# EasyEDA Pro project 主板.epro, board 主板
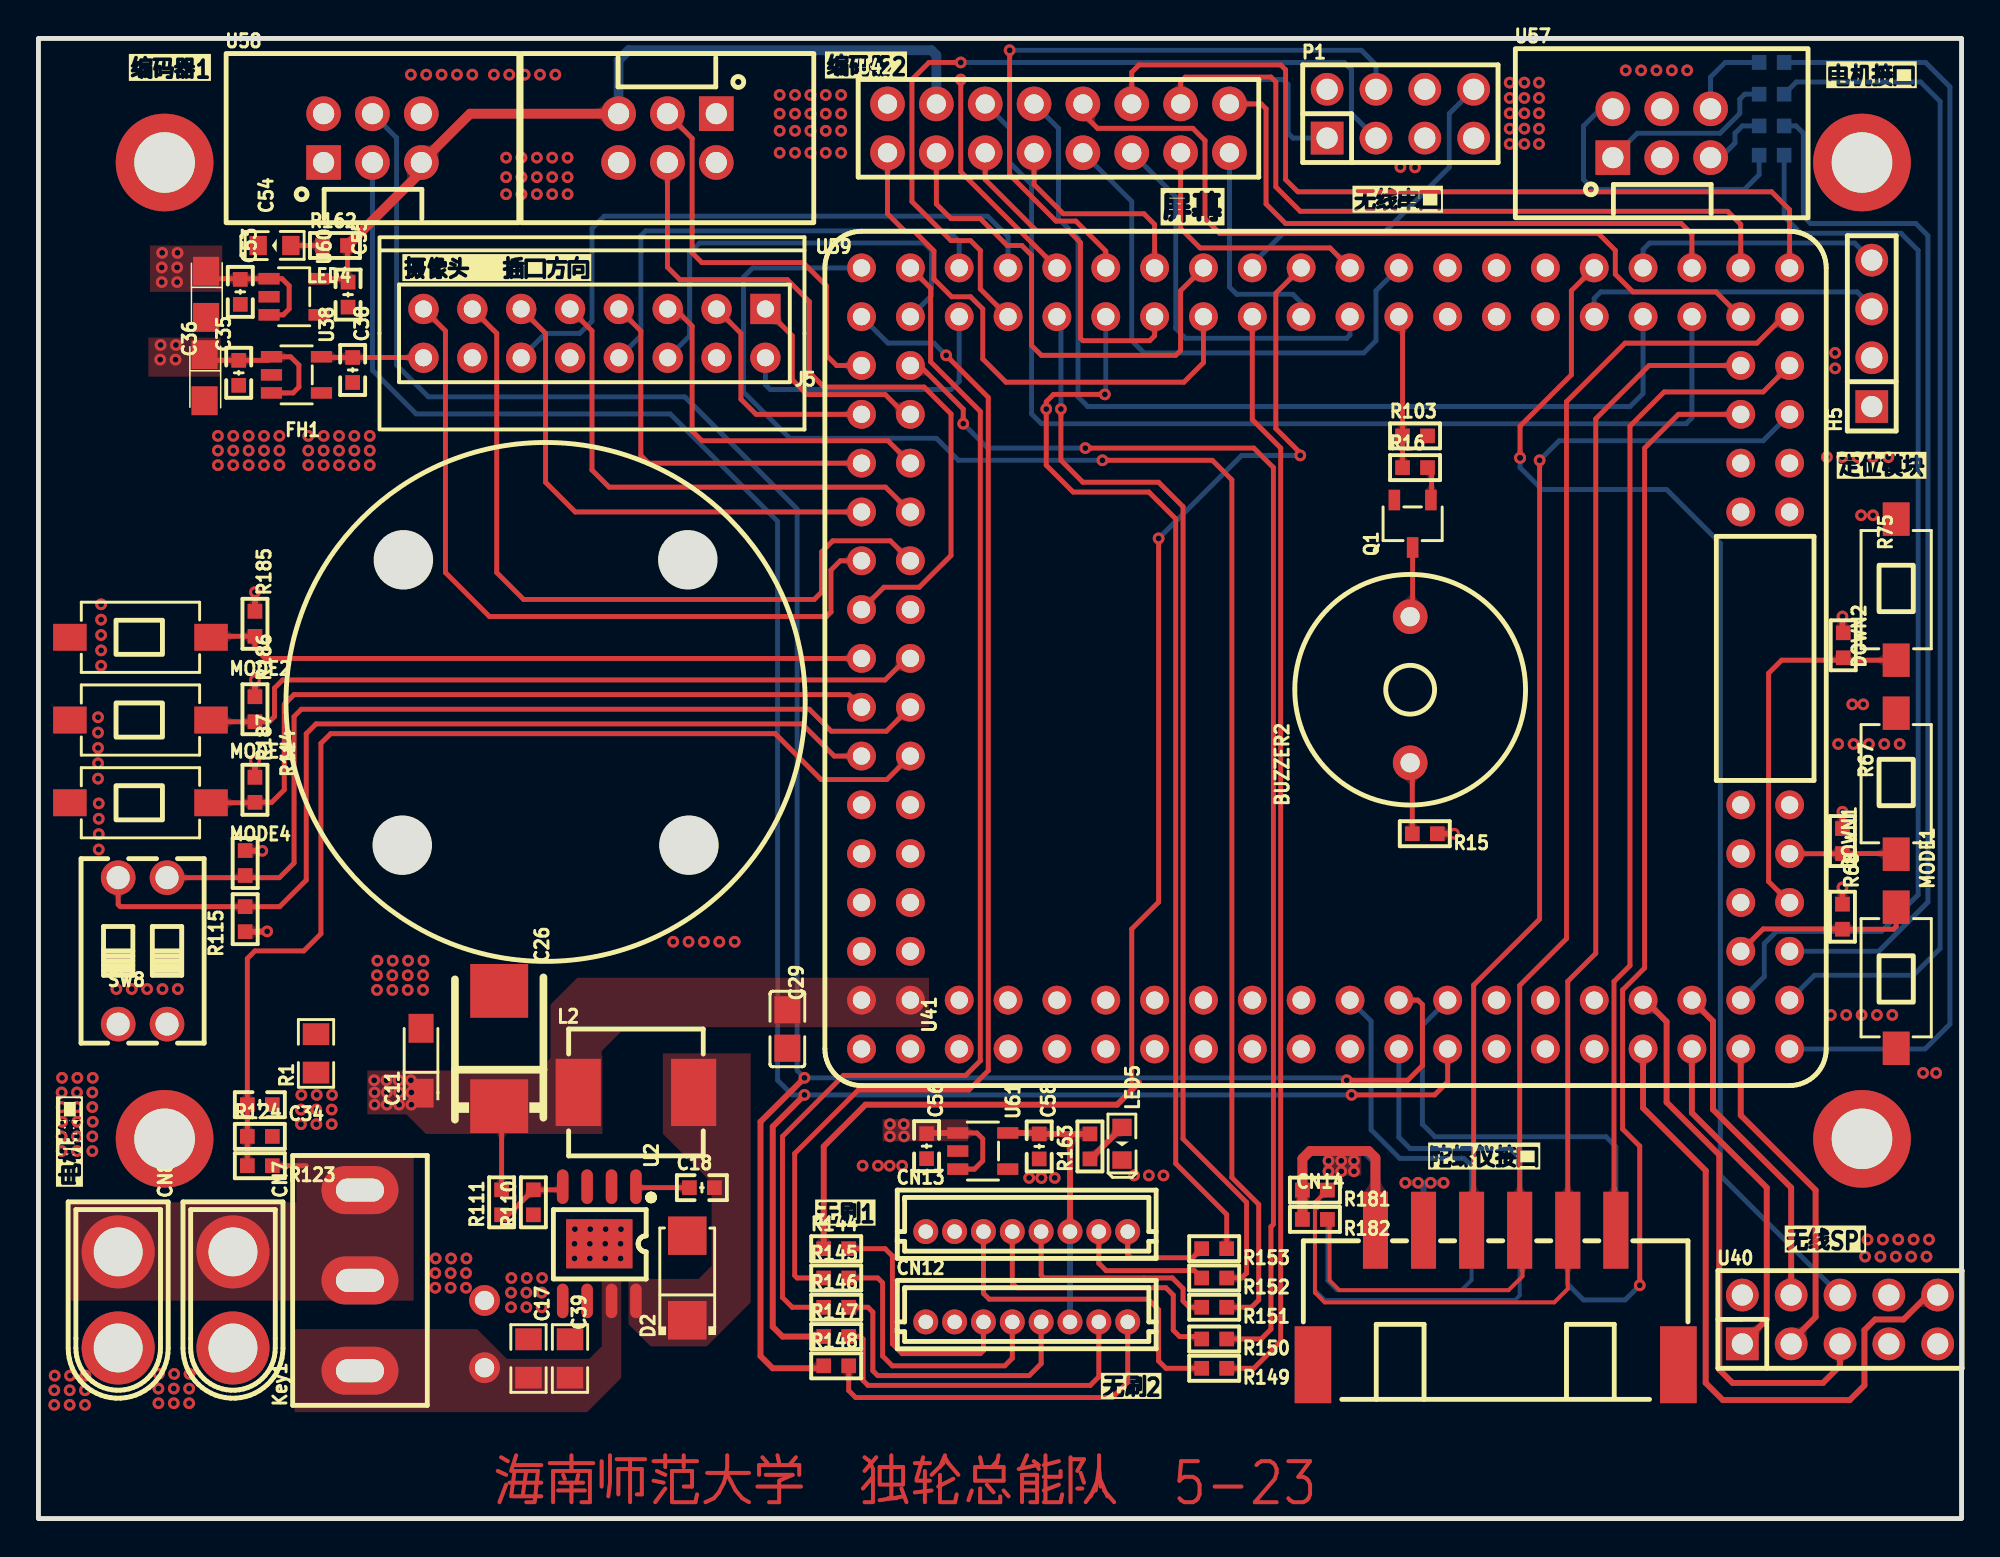
[diagram p1: board, top side]
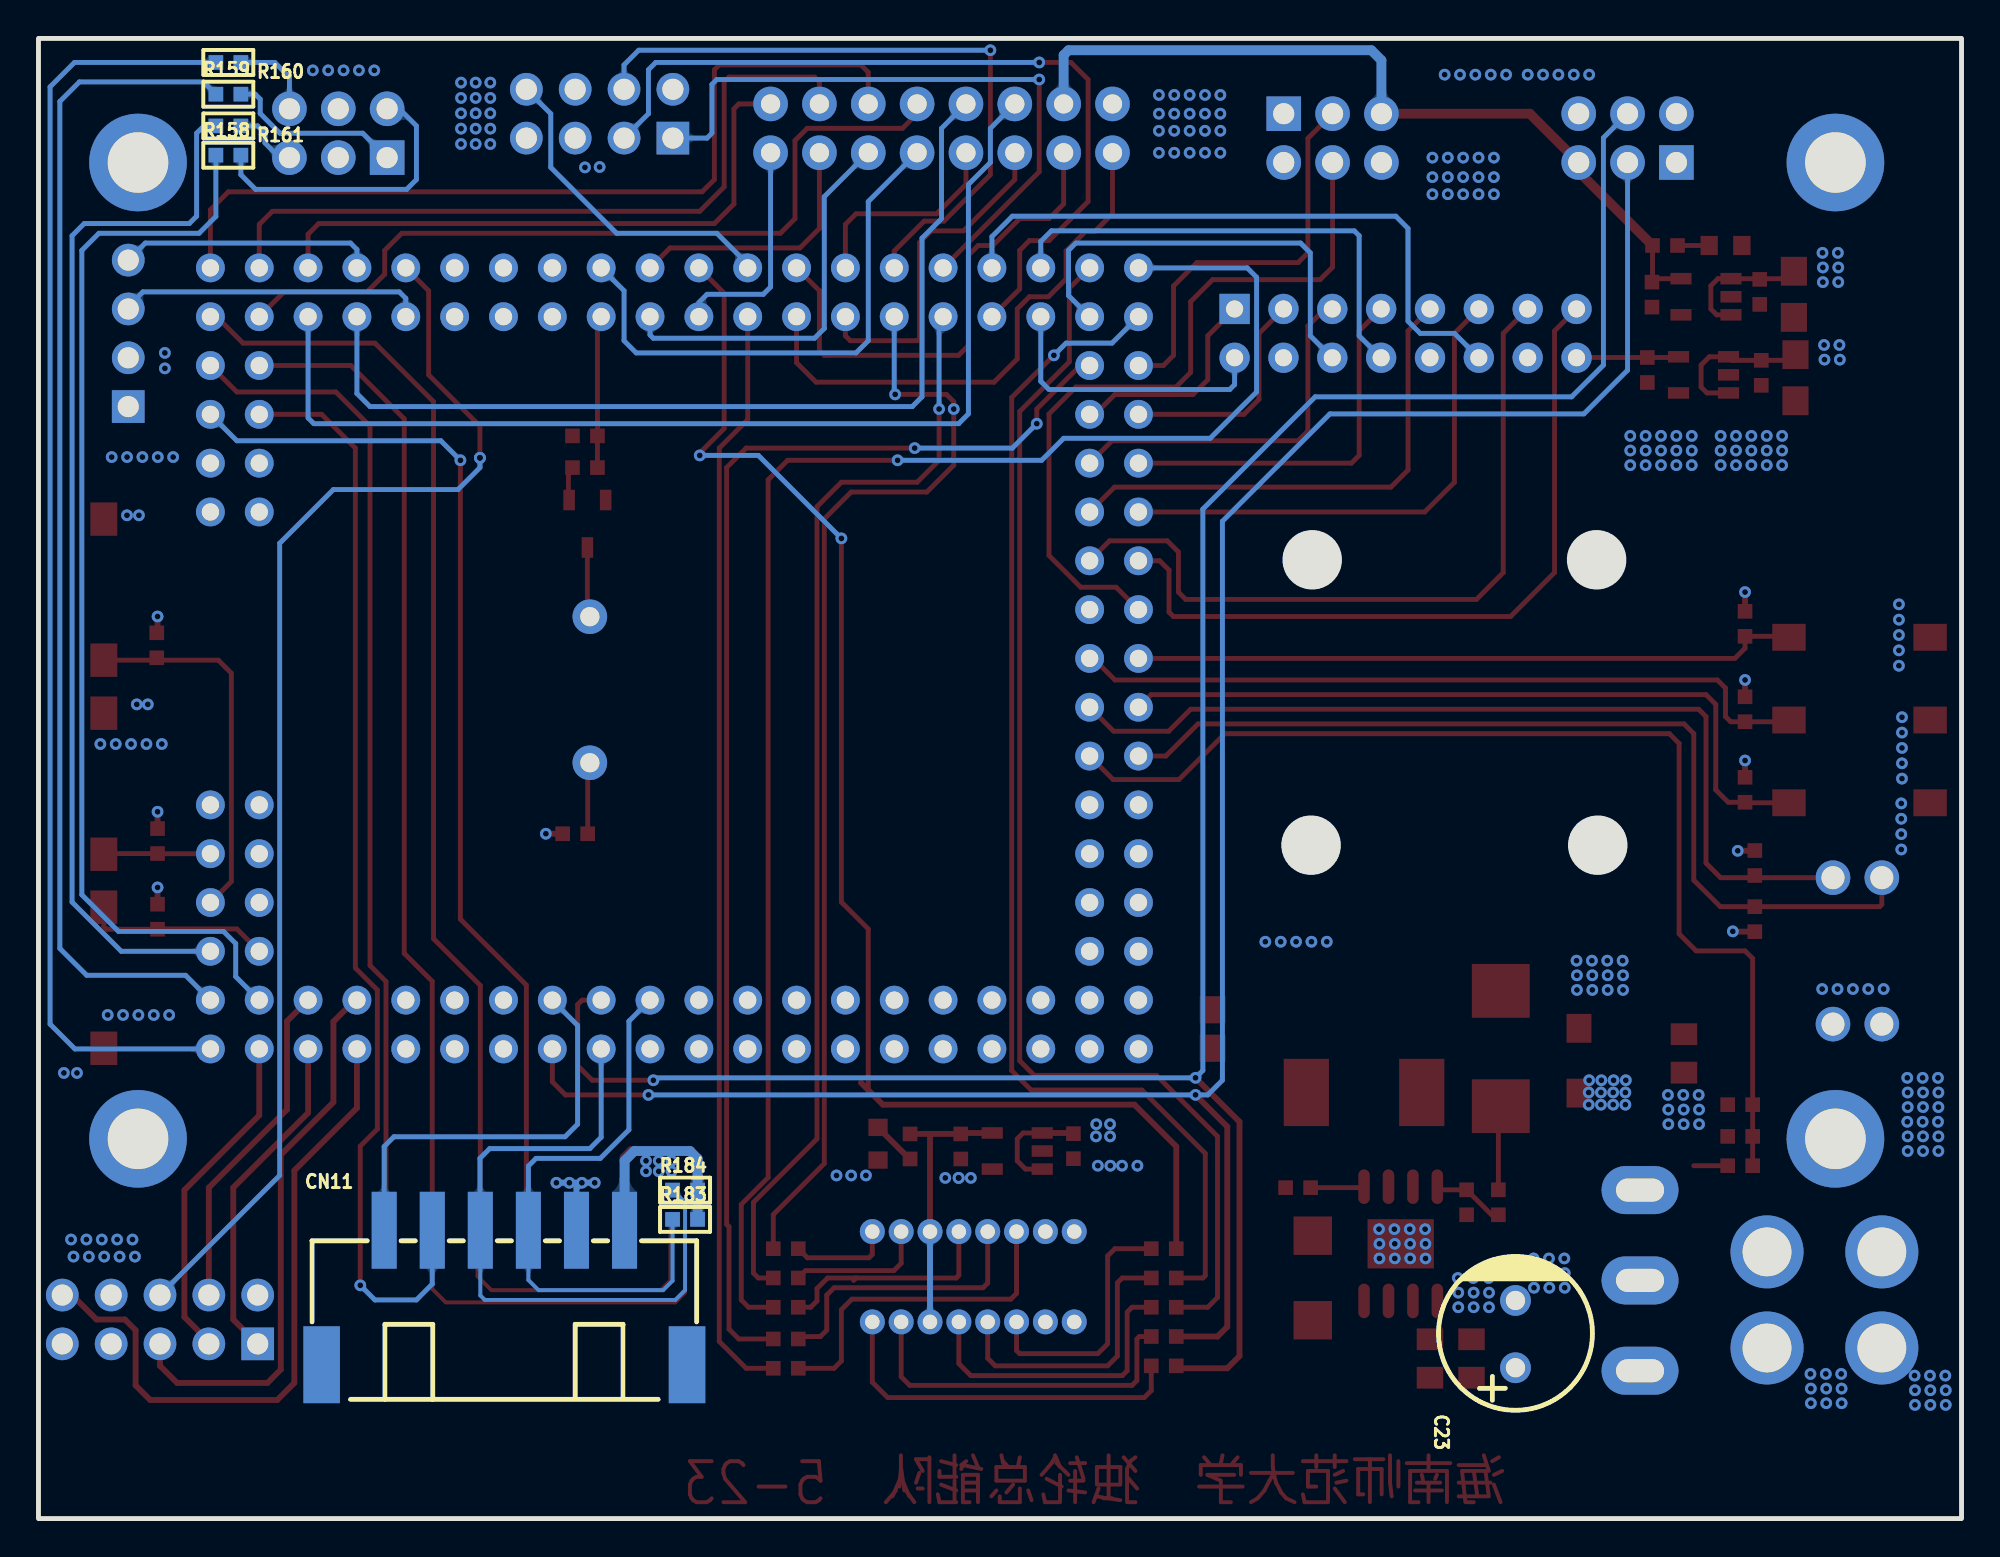
[diagram p2: board, bottom side, seen from below]

Outline 100 x 77.01 mm; copper layers: Top Layer, GND, VCC, Bottom Layer. Coordinates in mm from the lower left corner of the outline.
Outline path: rectangle 0,77.01 100,0
Stack: Top Layer 0.035mm 外层铜厚1oz / Dielectric1 0.2104mm 7628 RC49% 8.6mil / GND 0.035mm - / Dielectric2 1.065mm 1.1mm H/HOZ 含铜 / VCC 0.035mm - / Dielectric3 0.2104mm 7628 RC49% 8.6mil / Bottom Layer 0.035mm 外层铜厚1oz

## Design rules (mm)
template: 自定义配置
spacing copperThickness1oz (default): track to track 0.102, other pairs 0.152 to 0.3
spacing copperThickness2oz: track to track 0.203, other pairs 0.152 to 0.3
track width copperThickness1oz (default): min 0.127, default 0.254, max 2.54
track width copperThickness2oz: min 0.203, default 0.254, max 2.54
differential pair differentialPair (default): width min 0.127, default 0.254, max 2.54; gap min 0.152, default 0.152
via viaSize (default): diameter min 0.5, default 0.61, max 10; hole min 0.3, default 0.305, max 6.299
net GND uses copperRegion1
net VCC uses copperRegion1
net GND_MCU uses copperRegion2
net BAT uses copperRegion1

## Placement (name value [footprint] x y rotation side)
BUZZER2  2300Hz  [BUZ-TH_BD12.0-P7.60-D0.6-FD]  71.33 43.13 90 top
C11  10uF  [CAP-SMD_L3.2-W1.6-RD]  19.89 23.82 90 top
C17  47uf  [R0805_1]  25.48 8.33 270 top
C18  10nf  [电容0603 ad]  34.5 17.22 0 top
C23  470uf  [CAP-TH_BD8.0-P3.50-D0.6-FD]  23.2 9.6 90 bottom
C26  220uF  [CASE-D_7343]  23.96 24.46 270 top
C29  100NF  [C0805_1]  38.94 25.47 270 top
C34  100NF  [电容0603 ad]  11.51 21.54 180 top
C35  100nf  [电容0603 ad]  10.41 59.61 270 top
C36  10uF16V  [CASE-A_3216]  8.64 59.36 270 top
C38  100nf  [电容0603 ad]  16.34 59.76 270 top
C39  47uf  [R0805_1]  27.64 8.33 270 top
C53  100nf  [电容0603 ad]  10.5 63.83 270 top
C54  10uF16V  [CASE-A_3216]  8.72 63.7 270 top
C55  100nf  [电容0603 ad]  16.1 63.68 270 top
C56  100nf  [电容0603 ad]  46.18 19.38 270 top
C58  100nf  [电容0603 ad]  52.04 19.36 270 top
CN7  电机1  [conn-th_xt30u-m]  10.11 11.38 270 top
CN8  电机1  [conn-th_xt30u-m]  4.15 11.38 270 top
CN11  HX25003-6AWB  [CONN-SMD_6P-P2.50_HX25003-6AWB]  75.77 11.5 180 bottom
CN12  HC-ZH1.5-8A  [CONN-TH_HC-ZH1.5-8A]  51.39 10.23 0 top
CN13  HC-ZH1.5-8A  [CONN-TH_HC-ZH1.5-8A]  51.39 14.93 0 top
CN14  HX25003-6AWB  [CONN-SMD_6P-P2.50_HX25003-6AWB]  75.77 11.5 0 top
D2  ss34  [SMA_L4.3-W2.6-LS5.2-RD]  33.74 12.52 90 top
DOWN1  ST-1101NE-H H=4.3mm  [SW-SMD_L6.0-W3.5-LS8.0]  96.6 38.24 90 top
DOWN2  ST-1101NE-H H=4.3mm  [SW-SMD_L6.0-W3.5-LS8.0]  96.6 48.33 90 top
FH1  智能车逐飞摄像头固定孔  [智能车逐飞摄像头支架固定孔]  26.37 42.49 0 top
H5  PZ254V-11-04P  [HDR-TH_4P-P2.54-V-M]  95.33 61.67 90 top
J5  HDR-M-2.54_2x8  [HDR-M-2.54_2X8]  28.91 61.67 180 top
Key1  -  [MTS102/3脚2档]  16.72 12.39 90 top
L2  10UH  [IND-SMD_L7.3-W6.8]  31.07 22.17 0 top
LED4  LED-0603_R  [LED0603_RED]  12.27 66.24 180 top
LED5  LED-0603_R  [LED0603_RED]  56.34 19.5 270 top
MODE1  ST-1101NE-H H=4.3mm  [SW-SMD_L6.0-W3.5-LS8.0]  96.6 28.14 270 top
MODE2  ST-1101NE-H H=4.3mm  [SW-SMD_L6.0-W3.5-LS8.0]  5.3 45.85 180 top
MODE3  ST-1101NE-H H=4.3mm  [SW-SMD_L6.0-W3.5-LS8.0]  5.3 41.55 180 top
MODE4  ST-1101NE-H H=4.3mm  [SW-SMD_L6.0-W3.5-LS8.0]  5.3 37.24 180 top
NOREF  -  [Pad_e408]  6.56 19.76 0 top
NOREF#2  -  [Pad_e120]  6.56 70.56 0 top
NOREF#3  -  [Pad_e407]  94.82 19.76 0 top
NOREF#4  -  [Pad_e122]  94.82 70.56 0 top
P1  无线串口  [HDR-TH_8P-P2.54-V-M-R2-C4-S2.54]  70.82 73.1 0 top
Q1  S8050  [SOT-23-3_L2.9-W1.6-P1.90-LS2.8-BR]  71.46 51.76 90 top
R1  0R  [R0805_1]  14.43 24.2 90 top
R15  10R  [r0603 ad]  72.09 35.63 180 top
R16  4.7K  [r0603 ad]  71.58 54.68 0 top
R67  10K  [r0603 ad]  93.81 35.25 270 top
R68  10K  [r0603 ad]  93.81 31.31 270 top
R75  10K  [r0603 ad]  93.85 45.44 270 top
R103  1K  [r0603 ad]  71.58 56.33 0 top
R110  3.24k  [r0603 ad]  25.74 16.46 90 top
R111  10K  [r0603 ad]  24.08 16.46 90 top
R114  10K  [r0603 ad]  10.75 34.11 270 top
R115  10K  [r0603 ad]  10.75 31.19 90 top
R123  100k  [r0603 ad]  11.51 18.36 180 top
R124  10k  [r0603 ad]  11.51 19.88 0 top
R144  100R  [r0603 ad]  41.48 14.04 0 top
R145  100R  [r0603 ad]  41.48 12.52 0 top
R146  100R  [r0603 ad]  41.48 10.99 0 top
R147  100R  [r0603 ad]  41.48 9.47 0 top
R148  100R  [r0603 ad]  41.48 7.95 0 top
R149  100R  [r0603 ad]  61.14 7.82 180 top
R150  100R  [r0603 ad]  61.14 9.34 180 top
R151  100R  [r0603 ad]  61.14 10.99 180 top
R152  100R  [r0603 ad]  61.14 12.52 180 top
R153  100R  [r0603 ad]  61.14 14.04 180 top
R158  100R  [r0603 ad]  90.12 70.94 180 bottom
R159  100R  [r0603 ad]  90.12 74.11 180 bottom
R160  100R  [r0603 ad]  90.12 75.76 0 bottom
R161  100R  [r0603 ad]  90.12 72.46 0 bottom
R162  4.7k  [r0603 ad]  15.42 66.24 0 top
R163  4.7k  [r0603 ad]  54.68 19.36 90 top
R181  10K  [r0603 ad]  66.38 17.09 180 top
R182  10K  [r0603 ad]  66.38 15.57 180 top
R183  10K  [r0603 ad]  66.38 15.57 180 bottom
R184  10K  [r0603 ad]  66.38 17.09 180 bottom
R185  10K  [r0603 ad]  11.26 46.55 270 top
R186  10K  [r0603 ad]  11.26 42.11 270 top
R187  10K  [r0603 ad]  11.26 37.92 270 top
SW8  DSWB02LHGET  [SW-TH_DSWB02LHGET]  5.42 29.54 0 top
U2  TPS5430DDAR  [soic-8_l5.0-w4.0-p1.27-ls6.0-tl-ep]  29.16 14.3 270 top
U38  RT9013-3.3GB  [SOT-23-5_L2.9-W1.6-P0.94-LS2.8-BL]  13.42 59.51 270 top
U40  ZX-PZ2.54-2-5PZZ  [HDR-TH_10P-P2.54-V-M-R2-C5-S2.54]  93.68 10.36 0 top
U41  -  [TC264]  66.93 44.76 90 top
U42  PM254-2-08-Z-8.5  [HDR-TH_16P-P2.54-V-F-R2-C8-S2.54]  53.04 72.34 0 top
U57  2*3简牛  [CONN-TH_6P-P2.54_KINGHELM_KH-2.54PH180-2X3P-L8.9]  84.41 72.08 0 top
U58  2*3简牛  [CONN-TH_6P-P2.54_KINGHELM_KH-2.54PH180-2X3P-L8.9]  17.37 71.83 0 top
U59  2*3简牛  [CONN-TH_6P-P2.54_KINGHELM_KH-2.54PH180-2X3P-L8.9]  32.71 71.83 180 top
U60  RT9013-3.3GB  [SOT-23-5_L2.9-W1.6-P0.94-LS2.8-BL]  13.29 63.57 270 top
U61  RT9013-3.3GB  [SOT-23-5_L2.9-W1.6-P0.94-LS2.8-BL]  49.1 19.12 270 top

## Footprints (pads in the part's own frame, mm; a bottom-side part is the same pattern mirrored in y, then rotated)
BUZ-TH_BD12.0-P7.60-D0.6-FD
  round 1.8 hole 1: 1(-3.8,0) 2(3.8,0)
C0805_1
  rect 1.41x1.35 smd: 1(-1,0) 2(1,0)
CAP-SMD_L3.2-W1.6-RD
  rect 1.5x1.296 smd: 1(-1.687,0) 2(1.687,0)
CAP-TH_BD8.0-P3.50-D0.6-FD
  round 1.6 hole 1: 1(-1.75,0) 2(1.75,0)
CASE-A_3216
  rect 1.5x1.359 smd: 1(-1.2,0) 2(1.2,0)
CASE-D_7343
  rect 2.799x3.01 smd: 1(3,0) 2(-3,0)
CONN-SMD_6P-P2.50_HX25003-6AWB
  rect 1.3x4 smd: 1(-6.25,3.5) 2(-3.75,3.5) 3(-1.25,3.5) 4(1.25,3.5) 5(3.75,3.5) 6(6.25,3.5)
  rect 1.9x4 smd: 7(9.5,-3.5) 8(-9.5,-3.5)
CONN-TH_6P-P2.54_KINGHELM_KH-2.54PH180-2X3P-L8.9
  rect 1.8x1.8 hole 1.1: 1(-2.54,-1.27)
  round 1.8 hole 1.1: 2(-2.54,1.27) 3(0,-1.27) 4(0,1.27) 5(2.54,-1.27) 6(2.54,1.27)
CONN-TH_HC-ZH1.5-8A
  round 1.3 hole 0.75: 1(-5.25,0) 2(-3.75,0) 3(-2.25,0) 4(-0.75,0) 5(0.75,0) 6(2.25,0) 7(3.75,0) 8(5.25,0)
conn-th_xt30u-m
  round 3.8 hole 2.54: 1(2.5,0) 2(-2.5,0)
HDR-M-2.54_2X8
  rect 1.575x1.575 hole 0.889: 1(-8.89,-1.27)
  round 1.575 hole 0.889: 2(-8.89,1.27) 3(-6.35,-1.27) 4(-6.35,1.27) 5(-3.81,-1.27) 6(-3.81,1.27) 7(-1.27,-1.27) 8(-1.27,1.27) 9(1.27,-1.27) 10(1.27,1.27) 11(3.81,-1.27) 12(3.81,1.27) 13(6.35,-1.27) 14(6.35,1.27) 15(8.89,-1.27) 16(8.89,1.27)
HDR-TH_4P-P2.54-V-M
  rect 1.7x1.7 hole 1.1: 1(-3.81,0)
  round 1.7 hole 1.1: 2(-1.27,0) 3(1.27,0) 4(3.81,0)
HDR-TH_8P-P2.54-V-M-R2-C4-S2.54
  rect 1.7x1.7 hole 1.1: 1(-3.81,-1.27)
  round 1.7 hole 1.1: 2(-3.81,1.27) 3(-1.27,-1.27) 4(-1.27,1.27) 5(1.27,-1.27) 6(1.27,1.27) 7(3.81,-1.27) 8(3.81,1.27)
HDR-TH_10P-P2.54-V-M-R2-C5-S2.54
  rect 1.7x1.7 hole 1.1: 1(-5.08,-1.27)
  round 1.7 hole 1.1: 2(-5.08,1.27) 3(-2.54,-1.27) 4(-2.54,1.27) 5(0,-1.27) 6(0,1.27) 7(2.54,-1.27) 8(2.54,1.27) 9(5.08,-1.27) 10(5.08,1.27)
HDR-TH_16P-P2.54-V-F-R2-C8-S2.54
  round 1.8 hole 1: 1(-8.89,-1.27) 2(-8.89,1.27) 3(-6.35,-1.27) 4(-6.35,1.27) 5(-3.81,-1.27) 6(-3.81,1.27) 7(-1.27,-1.27) 8(-1.27,1.27) 9(1.27,-1.27) 10(1.27,1.27) 11(3.81,-1.27) 12(3.81,1.27) 13(6.35,-1.27) 14(6.35,1.27) 15(8.89,-1.27) 16(8.89,1.27)
IND-SMD_L7.3-W6.8
  rect 2.35x3.5 smd: 1(-3,0) 2(3,0)
LED0603_RED
  rect 0.9x1 smd: 1(-0.85,0) 2(0.85,0)
MTS102/3脚2档
  oval 2.5x4 hole 1.2x2.5: 1(-4.7,0) 2(0,0) 3(4.7,0)
Pad_e120
  round 5.08 hole 3.15: 9(0,0)
Pad_e122
  round 5.08 hole 3.15: 9(0,0)
Pad_e407
  round 5.08 hole 3.15: 9(0,0)
Pad_e408
  round 5.08 hole 3.15: 9(0,0)
r0603 ad
  rect 0.762x0.762 smd: 1(-0.65,0) 2(0.65,0)
R0805_1
  rect 1.133x1.377 smd: 1(-1,0) 2(1,0)
SMA_L4.3-W2.6-LS5.2-RD
  rect 2x2 smd: 1(-2.2,0) 2(2.2,0)
soic-8_l5.0-w4.0-p1.27-ls6.0-tl-ep
  oval 1.8x0.6 smd: 1(-2.971,1.905) 2(-2.971,0.635) 3(-2.971,-0.635) 4(-2.971,-1.905) 5(2.972,-1.905) 6(2.972,-0.635) 7(2.972,0.635) 8(2.972,1.905)
  rect 2.56x3.45 smd: 9(0,0)
SOT-23-3_L2.9-W1.6-P1.90-LS2.8-BR
  rect 1.07x0.6 smd: 1(1.235,-0.95) 2(1.235,0.95) 3(-1.235,0)
SOT-23-5_L2.9-W1.6-P0.94-LS2.8-BL
  rect 0.6x1.1 smd: 1(-0.94,-1.3) 2(0,-1.3) 3(0.94,-1.3) 4(0.94,1.3) 5(-0.94,1.3)
SW-SMD_L6.0-W3.5-LS8.0
  rect 1.74x1.4 smd: 1(-3.67,0) 2(3.67,0)
SW-TH_DSWB02LHGET
  round 1.8 hole 1.2: 1(-1.27,3.81) 2(1.27,3.81) 3(-1.27,-3.81) 4(1.27,-3.81)
TC264
  round 1.5 hole 0.9: 1(-20.32,24.13) 2(-17.78,24.13) 3(-20.32,21.59) 4(-17.78,21.59) 5(-20.32,19.05) 6(-17.78,19.05) 7(-20.32,16.51) 8(-17.78,16.51) 9(-20.32,13.97) 10(-17.78,13.97) 11(-20.32,11.43) 12(-17.78,11.43) 13(-20.32,8.89) 14(-17.78,8.89) 15(-20.32,6.35) 16(-17.78,6.35) 17(-20.32,3.81) 18(-17.78,3.81) 19(-20.32,1.27) 20(-17.78,1.27) 21(-20.32,-1.27) 22(-17.78,-1.27) 23(-20.32,-3.81) 24(-17.78,-3.81) 25(-20.32,-6.35) 26(-17.78,-6.35) 27(-20.32,-8.89) 28(-17.78,-8.89) 29(-20.32,-11.43) 30(-17.78,-11.43) 31(-20.32,-13.97) 32(-17.78,-13.97) 33(-20.32,-16.51) 34(-17.78,-16.51) 35(-20.32,-19.05) 36(-17.78,-19.05) 37(-20.32,-21.59) 38(-17.78,-21.59) 39(-20.32,-24.13) 40(-17.78,-24.13) 41(-15.24,-24.13) 42(-15.24,-21.59) 43(-12.7,-24.13) 44(-12.7,-21.59) 45(-10.16,-24.13) 46(-10.16,-21.59) 47(-7.62,-24.13) 48(-7.62,-21.59) 49(7.62,-21.59) 50(7.62,-24.13) 51(10.16,-21.59) 52(10.16,-24.13) 53(12.7,-21.59) 54(12.7,-24.13) 55(15.24,-21.59) 56(15.24,-24.13) 57(17.78,-24.13) 58(20.32,-24.13) 59(17.78,-21.59) 60(20.32,-21.59) 61(17.78,-19.05) 62(20.32,-19.05) 63(17.78,-16.51) 64(20.32,-16.51) 65(17.78,-13.97) 66(20.32,-13.97) 67(17.78,-11.43) 68(20.32,-11.43) 69(17.78,-8.89) 70(20.32,-8.89) 71(17.78,-6.35) 72(20.32,-6.35) 73(17.78,-3.81) 74(20.32,-3.81) 75(17.78,-1.27) 76(20.32,-1.27) 77(17.78,1.27) 78(20.32,1.27) 79(17.78,3.81) 80(20.32,3.81) 81(17.78,6.35) 82(20.32,6.35) 83(17.78,8.89) 84(20.32,8.89) 85(17.78,11.43) 86(20.32,11.43) 87(17.78,13.97) 88(20.32,13.97) 89(17.78,16.51) 90(20.32,16.51) 91(17.78,19.05) 92(20.32,19.05) 93(17.78,21.59) 94(20.32,21.59) 95(17.78,24.13) 96(20.32,24.13) 97(15.24,21.59) 98(15.24,24.13) 99(12.7,21.59) 100(12.7,24.13) 101(10.16,21.59) 102(10.16,24.13) 103(7.62,21.59) 104(7.62,24.13) 105(5.08,21.59) 106(5.08,24.13) 107(2.54,21.59) 108(2.54,24.13) 109(0,21.59) 110(0,24.13) 111(-2.54,21.59) 112(-2.54,24.13) 113(-5.08,21.59) 114(-5.08,24.13) 115(-7.62,21.59) 116(-7.62,24.13) 117(-10.16,21.59) 118(-10.16,24.13) 119(-12.7,21.59) 120(-12.7,24.13) 121(-15.24,21.59) 122(-15.24,24.13)
电容0603 ad
  rect 0.762x0.762 smd: 1(0.65,0) 2(-0.65,0)

## Nets
As in the schematic, except:
VCC: C11.1 C26.1 C29.1 C35.2 C36.1 C53.2 C54.1 C56.2 CN11.6 CN14.1 H5.1 L2.1 P1.7 R15.1 R67.1 R68.1 R75.1 R111.2 R114.1 R115.1 R181.2 R182.2 R183.2 R184.2 R185.1 R186.1 R187.1 U38.1 U38.3 U40.9 U41.2 U41.4 U60.1 U60.3 U61.1 U61.3

Pads without a net: CN11 7 8; CN14 7 8; J5 10; NOREF 9; NOREF#2 9; NOREF#3 9; NOREF#4 9; P1 2; U2 2 3 5; U38 4; U40 2; U41 5 6 7 8 9 10 11 12 13 14 15 16 17 18 19 20 21 28 29 30 31 32 47 48 115 116 117 118 119 120 121; U58 1 2; U59 1 2; U60 4; U61 4

## Via types
v1: diameter 0.61, hole 0.305, Top Layer to Bottom Layer, 317 vias

## Routing (per net, layer and track width the routed paths; a pad name or vN(x,y) marks a point on that pad's centre or on a via; arc(x,y) is an arc through that point)
3V3: length 56.9
  Top Layer w0.254: C55.2 16.07,64.36 16.07,64.4 ; 16.07,64.4 15.95,64.51 U60.5 ; 16.07,64.4 R162.2
  Top Layer w0.305: 53.66,20.01 C58.2 51.99,20.06 U61.5 ; 53.66,20.01 R163.2 ; 53.66,20.01 53.64,19.99 CN13.6
  Top Layer w0.508: U59.5 22.45,73.1 19.91,70.56 19.91,70.08 R162.2
  Bottom Layer w0.305: CN13.6 CN12.6
  Bottom Layer w0.508: U42.4 46.69,76.15 46.44,76.4 30.69,76.4 30.17,75.88 U59.5
3V3_CAM: length 5.3
  Top Layer w0.254: 14.84,60.58 15.01,60.41 C38.2 20.01,60.41 J5.16
GND:
  vias: v1(0.84,7.44) v1(0.82,6.68) v1(0.82,5.91) v1(1.22,22.93) v1(1.2,22.17) v1(1.2,21.41) v1(1.22,20.65) v1(1.2,19.88) v1(1.2,19.12) v1(1.64,7.44) v1(1.62,6.68) v1(1.62,5.91) v1(2.02,22.93) v1(2,22.17) v1(2,21.41) v1(2.02,20.65) v1(2,19.88) v1(2,19.12) v1(2.44,7.44) v1(2.42,6.68) v1(2.42,5.91) v1(2.82,22.93) v1(2.8,22.17) v1(2.8,21.41) v1(2.82,20.65) v1(2.8,19.88) v1(2.8,19.12) v1(6.26,7.53) v1(6.24,6.76) v1(6.24,6) v1(7.06,7.53) v1(7.04,6.76) v1(7.04,6) v1(7.86,7.53) v1(7.84,6.76) v1(7.84,6) v1(13.67,22.04) v1(13.65,21.28) v1(13.65,20.52) v1(14.47,22.04) v1(14.45,21.28) v1(14.45,20.52) v1(15.27,22.04) v1(15.25,21.28) v1(15.25,20.52) v1(20.66,13.53) v1(20.63,12.77) v1(20.63,12.01) v1(21.45,13.53) v1(21.43,12.77) v1(21.43,12.01) v1(22.25,13.53) v1(22.23,12.77) v1(22.23,12.01) v1(24.57,11.76) v1(24.57,10.99) v1(24.59,12.52) v1(25.37,11.76) v1(25.37,10.99) v1(25.39,12.52) v1(26.17,11.76) v1(26.17,10.99) v1(26.19,12.52)
GND_MCU: length 4.6
  Bottom Layer w0.305: v1(71.74,17.47) v1(71.07,17.47) ; v1(71.74,17.47) 72.02,17.19 CN14.2 ; v1(71.74,17.47) v1(72.39,17.47) v1(73.07,17.47)
  vias: v1(3.1,41.7) v1(3.1,40.9) v1(3.1,40.1) v1(3.1,39.3) v1(3.1,38.5) v1(3.13,37.21) v1(3.13,36.41) v1(3.13,35.61) v1(3.13,34.81) v1(3.26,47.57) v1(3.26,46.77) v1(3.26,45.97) v1(3.26,45.17) v1(3.26,44.37) v1(4.05,27.55) v1(4.85,27.55) v1(5.65,27.55) v1(6.45,27.55) v1(7.25,27.55) v1(9.33,56.33) v1(9.33,55.57) v1(9.33,54.81) v1(10.13,56.33) v1(10.13,55.57) v1(10.13,54.81) v1(10.93,56.33) v1(10.93,55.57) v1(10.93,54.81) v1(11.73,56.33) v1(11.73,55.57) v1(11.73,54.81) v1(12.53,56.33) v1(12.53,55.57) v1(12.53,54.81) v1(14.03,56.33) v1(14.03,55.57) v1(14.03,54.81) v1(14.83,56.33) v1(14.83,55.57) v1(14.83,54.81) v1(15.63,56.33) v1(15.63,55.57) v1(15.63,54.81) v1(16.43,56.33) v1(16.43,55.57) v1(16.43,54.81) v1(17.23,56.33) v1(17.23,55.57) v1(17.23,54.81) v1(17.62,29.03) v1(17.6,28.27) v1(17.6,27.5) v1(18.42,29.03) v1(18.4,28.27) v1(18.4,27.5) v1(19.22,29.03) v1(19.2,28.27) v1(19.2,27.5) v1(19.36,75.13) v1(20.02,29.03) v1(20,28.27) v1(20,27.5) v1(20.16,75.13) v1(20.96,75.13) v1(21.76,75.13) v1(22.56,75.13) v1(23.68,75.13) v1(24.32,70.81) v1(24.32,69.8) v1(24.32,68.91) v1(24.48,75.13) v1(25.12,70.81) v1(25.12,69.8) v1(25.12,68.91) v1(25.28,75.13) v1(25.92,70.81) v1(25.92,69.8) v1(25.92,68.91) v1(26.08,75.13) v1(26.71,70.81) v1(26.71,69.8) v1(26.71,68.91) v1(26.88,75.13) v1(27.51,70.81) v1(27.51,69.8) v1(27.51,68.91) v1(27.87,14.3) v1(27.87,13.53) v1(27.89,15.06) v1(28.67,14.3) v1(28.67,13.53) v1(28.69,15.06) v1(29.47,14.3) v1(29.47,13.53) v1(29.49,15.06) v1(30.27,14.3) v1(30.27,13.53) v1(30.29,15.06) v1(33.01,30.01) v1(33.81,30.01) v1(34.61,30.01) v1(35.4,30.01) v1(36.2,30.01) v1(38.54,74.07) v1(38.54,73.1) v1(38.54,72.21) v1(38.54,71.07) v1(39.34,74.07) v1(39.34,73.1) v1(39.34,72.21) v1(39.34,71.07) v1(40.14,74.07) v1(40.14,73.1) v1(40.14,72.21) v1(40.14,71.07) v1(40.94,74.07) v1(40.94,73.1) v1(40.94,72.21) v1(40.94,71.07) v1(41.74,74.07) v1(41.74,73.1) v1(41.74,72.21) v1(41.74,71.07) v1(42.86,18.36) v1(43.66,18.36) v1(44.26,18.36) v1(44.91,18.36) v1(51.52,17.73) v1(52.15,17.73) v1(52.15,17.73) v1(52.84,17.73) v1(56.97,17.85) v1(57.74,17.85) v1(58.5,17.85) v1(70.82,70.32) v1(71.58,70.3) v1(76.5,74.72) v1(76.5,73.92) v1(76.5,73.12) v1(76.5,72.32) v1(76.5,71.52) v1(77.27,74.72) v1(77.27,73.92) v1(77.27,73.12) v1(77.27,72.32) v1(77.27,71.52) v1(78.03,74.72) v1(78.03,73.92) v1(78.03,73.12) v1(78.03,72.32) v1(78.03,71.52) v1(82.54,75.35) v1(83.34,75.35) v1(84.14,75.35) v1(84.93,75.35) v1(85.73,75.35) v1(93,55.23) v1(93.21,26.2) v1(93.43,60.65) v1(93.43,59.85) v1(93.59,40.3) v1(93.8,55.23) v1(94,26.2) v1(94.32,42.36) v1(94.39,40.3) v1(94.59,55.23) v1(94.78,52.2) v1(94.8,26.2) v1(94.89,42.36) v1(94.98,13.63) v1(95.11,14.52) v1(95.18,40.3) v1(95.39,55.23) v1(95.4,52.2) v1(95.6,26.2) v1(95.78,13.63) v1(95.91,14.52) v1(95.98,40.3) v1(96.19,55.23) v1(96.4,26.2) v1(96.58,13.63) v1(96.71,14.52) v1(96.78,40.3) v1(97.38,13.63) v1(97.51,14.52) v1(98,23.19) v1(98.18,13.63) v1(98.31,14.52) v1(98.68,23.19)
VCC: length 55.3
  Top Layer w0.254: U60.3 12.73,62.63 13.04,62.94 13.04,64.14 12.67,64.51 U60.1 9.1,64.51 C54.1 ; U38.3 13.24,58.57 13.54,58.87 13.54,60.02 13.11,60.45 U38.1 11.93,60.26 C35.2 8.93,60.26 C36.1 ; U61.3 48.67,18.18 49.1,18.61 49.1,19.76 48.8,20.06 48.19,20.06 ; C26.1 24.08,21.33 R111.2
  Top Layer w0.305: R114.1 10.76,34.74 v1(11.64,34.74) ; v1(93.81,46.94) 93.81,46.13 R75.1 ; R185.1 v1(11.26,48.21) ; R15.1 v1(73.61,35.63) ; v1(11.89,30.55) 11.88,30.54 R115.1 ; C56.2 46.22,20.06 U61.1 48.19,20.06 ; v1(93.81,32.84) R68.1 ; R187.1 v1(11.26,39.44) ; R186.1 v1(11.26,43.63) ; v1(93.81,36.78) R67.1
  Top Layer w0.508: R182.2 R181.2 65.73,18.73 66.12,19.12 69.17,19.12 69.52,18.77 CN14.1
  Bottom Layer w0.508: CN14.1 69.52,18.61 69.02,19.12 66.12,19.12 65.73,18.73 R181.2 R182.2
  vias: v1(6.35,61.06) v1(6.33,60.3) v1(6.43,65.86) v1(6.41,65.1) v1(6.41,64.33) v1(7.15,61.06) v1(7.13,60.3) v1(7.23,65.86) v1(7.21,65.1) v1(7.21,64.33) v1(17.46,22.81) v1(17.48,22.17) v1(17.48,21.54) v1(18.09,22.81) v1(18.12,22.17) v1(18.12,21.54) v1(18.73,22.81) v1(18.75,22.17) v1(18.75,21.54) v1(19.37,22.81) v1(19.39,22.17) v1(19.39,21.54) v1(44.28,20.52) v1(44.28,19.88) v1(44.99,20.52) v1(45.01,19.88) v1(67.08,18.61) v1(67.08,18.07) v1(67.74,18.61) v1(67.74,18.07) v1(68.41,18.61) v1(68.41,18.07)
00.0: length 11.1
  Top Layer w0.254: U41.99 45.06,57.45 44.03,58.48 39.97,58.48 39.2,59.25 39.2,61.54 J5.1
00.1: length 11.8
  Top Layer w0.254: J5.3 36.53,61.67 36.53,58.24 37.31,57.45 U41.100
00.2: length 19.1
  Top Layer w0.254: J5.5 33.1,62.94 33.99,62.05 33.99,56.59 34.5,56.08 44.17,56.08 U41.101
00.3: length 19.7
  Top Layer w0.254: U41.102 31.73,54.92 31.32,55.32 31.32,61.79 J5.7
00.4: length 26.3
  Top Layer w0.254: J5.9 28.78,61.79 28.78,54.56 29.67,53.67 44.05,53.67 U41.103
00.5: length 26.6
  Top Layer w0.254: U41.104 27.92,52.38 26.37,53.92 26.37,61.67 J5.11
00.6: length 39.2
  Top Layer w0.254: J5.13 23.83,61.67 23.83,49.22 25.23,47.82 40.34,47.82 40.72,48.21 40.72,50.29 41.3,50.87 44.3,50.87 U41.105
00.7: length 39.3
  Top Layer w0.254: U41.106 41.7,49.84 41.21,49.35 41.21,47.16 40.98,46.94 23.45,46.94 21.16,49.22 21.16,61.79 J5.15
00.9: length 38.7
  Top Layer w0.254: U41.108 43.96,48.46 45.8,48.46 47.45,50.11 47.45,57.48 46.06,58.87 40.85,58.87 40.09,59.64 40.09,63.32 38.94,64.46 33.36,64.46 32.71,65.11 U59.4
00.12: length 38.6
  Top Layer w0.254: MODE3.1 9.06,41.46 12,41.46 12.27,41.73 12.27,43.21 12.7,43.63 44.02,43.63 45.15,44.76 U41.109
02.0: length 33.3
  Bottom Layer w0.254: U41.90 50.42,66.7 49.36,67.76 29.42,67.76 28.78,67.13 28.78,62.3 28.15,61.67 26.37,61.67 J5.12
02.1: length 15.1
  Bottom Layer w0.254: J5.2 37.8,59 38.05,58.75 47.45,58.75 47.88,59.17 U41.91
02.2: length 25.1
  Bottom Layer w0.254: U41.92 47.88,66.45 47.33,67 31.58,67 31.32,66.75 31.32,61.54 J5.8
02.3: length 22.8
  Bottom Layer w0.254: J5.6 33.86,61.54 33.86,65.86 34.37,66.37 46.06,66.37 46.44,65.99 46.44,63.63 U41.93
02.4: length 65.4
  Top Layer w0.254: U41.94 46.39,64.02 46.39,60.19 48.98,57.6 48.98,23.82 48.21,23.06 41.86,23.06 38.69,19.88 38.69,11.5 39.2,10.99 40.83,10.99
02.5: length 63.1
  Top Layer w0.254: v1(47.2,60.52) 49.39,58.33 49.39,23.31 48.38,22.3 42.63,22.3 39.32,19 39.32,12.65 39.45,12.52 40.83,12.52
  Bottom Layer w0.254: v1(47.2,60.52) 46.56,61.16 44.17,61.16 U41.95
02.6: length 84.7
  Top Layer w0.254: R151.1 63.07,10.99 63.45,11.38 63.45,16.34 62.06,17.74 62.06,54.05 61.04,55.06 v1(55.33,55.06)
  Bottom Layer w0.254: U41.96 37.14,65.08 36.66,64.59 36.66,58.62 39.07,56.21 46.69,56.21 47.83,55.06 v1(55.33,55.06)
02.7: length 68.9
  Top Layer w0.254: v1(54.44,55.7) 63.2,55.7 64.22,54.68 64.22,15.31 64.09,15.19 64.09,9.85 63.58,9.34 61.79,9.34 ; U41.97 45.82,60 48.09,57.73 v1(48.09,56.97)
  Bottom Layer w0.254: v1(48.09,56.97) 49.36,55.7 v1(54.44,55.7)
02.8: length 21.1
  Top Layer w0.254: U59.3 33.99,71.81 33.99,65.86 34.5,65.35 39.76,65.35 40.98,64.14 40.98,60.52 41.5,60 U41.98
10.1: length 57.5
  Top Layer w0.254: v1(55.45,58.49) 52.79,58.49 52.41,58.11 v1(52.41,57.73) 52.41,54.81 53.8,53.41 57.74,53.41 59.14,52.02 59.14,18.47 61.79,15.82 R153.1
  Bottom Layer w0.254: v1(55.45,58.49) 55.5,58.54 U41.85
10.2: length 34.6
  Top Layer w0.254: v1(50.5,76.4) 50.5,69.92 52.91,67.51 53.94,67.51 55.5,65.95 U41.86
  Bottom Layer w0.254: 69.55,74.37 69.55,75.64 68.79,76.4 v1(50.5,76.4)
10.3: length 57.3
  Top Layer w0.254: v1(53.17,57.73) 53.17,55.06 54.31,53.92 58.25,53.92 59.52,52.65 59.52,19.76 62.82,16.46 62.82,12.77 62.57,12.52 R152.1
  Bottom Layer w0.254: U41.87 53.17,62.33 v1(53.17,57.73)
10.5: length 33.7
  Top Layer w0.254: U41.88 47.96,70.07 v1(47.96,74.88)
  Bottom Layer w0.254: P1.1 65.23,71.83 64.98,72.08 64.98,74.62 64.72,74.88 v1(47.96,74.88)
10.6: length 42.3
  Top Layer w0.254: 47.83,75.76 46.31,75.76 45.42,74.88 45.42,68.53 47.45,66.49 48.47,66.49 48.98,65.99 48.98,63.98 U41.89
  Bottom Layer w0.254: P1.3 68.28,73.1 68.28,75.38 67.9,75.76 v1(47.96,75.76)
11.2: length 72.4
  Top Layer w0.254: U41.78 64.34,63.76 64.34,56.71 65.61,55.44 v1(65.61,55.32) ; 56.85,22.3 56.85,30.68 58.25,32.08 v1(58.25,51)
  Top Layer w0.305: 57.23,22.68 56.09,21.54 43.01,21.54 40.83,19.36 40.83,14.04
  Bottom Layer w0.254: v1(65.61,55.32) 62.57,55.32 v1(58.25,51)
11.3: length 57.3
  Top Layer w0.254: R149.1 63.2,7.82 64.6,9.22 64.6,55.7 63.12,57.18 U41.79
11.6: length 17.1
  Bottom Layer w0.254: U41.80 63.12,65.27 64.72,66.87 69.93,66.87 73.36,70.3 73.36,73.1 74.63,74.37
11.9: length 28.4
  Top Layer w0.254: U41.81 60.58,60.14 59.56,59.13 50.31,59.13 49.1,60.34 49.1,62.94 48.47,63.57 47.49,63.57 46.56,64.49 46.56,65.96 45.55,66.97 45.07,66.97 44.15,67.89 U42.1
11.10: length 26.3
  Top Layer w0.254: U41.82 59.39,63.89 59.39,60.78 59.14,60.52 52.15,60.52 51.64,61.03 51.64,65.73 51.14,66.24 50.37,66.24 48.98,67.64 47.45,67.64 46.69,68.4 U42.3
11.11: length 17.7
  Top Layer w0.254: U42.5 49.23,69.67 51.9,67 53.57,67 54.18,66.39 54.18,61.41 54.31,61.29 57.78,61.29 58.04,61.54 U41.83
11.12: length 11
  Top Layer w0.254: U42.7 51.77,69.41 53.29,67.89 57.49,67.89 58.04,67.34 U41.84
13.0: length 28.3
  Bottom Layer w0.254: U41.74 69.55,63.89 69.55,61.29 68.92,60.65 57.49,60.65 56.85,61.29 56.85,68.53 U42.9
13.1: length 20.4
  Bottom Layer w0.254: U42.11 59.14,68.78 59.14,61.92 59.64,61.41 68.03,61.41 68.2,61.59 U41.75
13.2: length 13.6
  Top Layer w0.254: U41.76 67.16,66.11 60.41,66.11 59.39,67.13 U42.13
13.3: length 11.8
  Bottom Layer w0.254: U42.15 61.93,64.08 62.31,63.7 65.23,63.7 65.66,63.27 U41.77
14.6: length 7.9
  Top Layer w0.254: R16.1 R103.1 70.93,62.34 U41.73
15.0: length 45.5
  Top Layer w0.254: U42.12 56.85,75.26 57.23,75.64 64.6,75.64 64.85,75.38 64.85,69.67 65.49,69.03 90.12,69.03 91.06,68.1 U41.58
15.1: length 42.2
  Top Layer w0.254: U42.10 54.31,73.1 55.07,72.34 60.03,72.34 60.66,71.7 60.66,67.64 61.42,66.87 81.11,66.87 82,65.99 82,64.74 82.91,63.83 87.23,63.83 U41.59
15.2: length 39
  Top Layer w0.254: U42.14 59.39,74.75 59.64,75 64.09,75 64.34,74.75 64.34,69.29 65.61,68.02 87.84,68.02 88.52,67.34 U41.60
15.3: length 57.1
  Bottom Layer w0.254: U42.6 50.5,72.34 50.5,70.56 51.64,69.41 51.64,57.48 52.15,56.97 85.68,56.97 85.98,57.27 U41.61
15.4: length 31.5
  Top Layer w0.254: U41.62 85.98,66.83 85.43,67.38 64.85,67.38 63.84,68.4 63.84,73.35 63.58,73.61 U42.16
15.5: length 50.1
  Bottom Layer w0.254: U42.8 53.04,72.34 53.04,67.64 54.06,66.62 54.06,58.37 54.56,57.86 82.76,57.86 83.44,58.54 U41.63
15.6: length 13.4
  Bottom Layer w0.254: U41.64 83.44,66.03 83.77,66.37 94.44,66.37 H5.4
15.7: length 15.8
  Bottom Layer w0.254: 95.33,63.06 94.57,63.83 81.23,63.83 80.9,63.49 U41.65
15.8: length 65.7
  Top Layer w0.254: v1(77.04,55.19) 77.04,56.84 79.71,59.51 79.71,63.89 U41.66
  Bottom Layer w0.254: U40.6 87.46,17.85 87.46,50.75 84.66,53.54 78.19,53.54 77.04,54.68 v1(77.04,55.19)
20.2: length 5.6
  Top Layer w0.254: U41.45 93.8,34.59 R67.2 96.57,34.6 DOWN1.1
20.10: length 57.3
  Top Layer w0.254: v1(83.27,12.14) 83.27,19.38 82.38,20.27 82.38,27.5 83.52,28.65 83.52,55.7 85.28,57.45 U41.53
  Bottom Layer w0.254: CN11.2 79.52,12.2 80.35,11.38 82.5,11.38 v1(83.27,12.14)
20.11: length 55.5
  Top Layer w0.254: CN14.3 74.63,15.11 74.63,27.76 78.06,31.19 v1(78.06,55.06)
  Bottom Layer w0.254: U41.54 89.68,56.08 79.08,56.08 v1(78.06,55.06)
20.12: length 74.2
  Top Layer w0.203: 66.5,16.57 66.38,16.44 66.38,11.76 66.88,11.25 78.82,11.25 79.52,11.95 CN14.5 ; 66.5,16.57 R181.1 ; 66.5,16.57 66.5,16.16
  Top Layer w0.254: CN14.5 79.52,27.95 80.98,29.41 80.98,57.22 83.75,60 U41.55
20.13: length 51.8
  Top Layer w0.254: CN14.6 81.93,15.1 81.93,27.94 82.76,28.77 82.76,56.84 84.54,58.62 89.68,58.62 U41.56
20.14: length 73.8
  Top Layer w0.203: CN14.4 77.17,14.86 77.17,12.61 76.45,11.88 67.65,11.88 67.14,12.39 67.14,15.45 R182.1
  Top Layer w0.254: U41.57 90.74,62.53 89.36,61.16 82.5,61.16 79.46,58.11 79.46,30.17 77.02,27.74 CN14.4
21.2: length 56.9
  Bottom Layer w0.254: R158.1 90.77,67.75 91.65,66.87 96.86,66.87 97.74,65.99 97.74,32.46 95.84,30.55 90.38,30.55 89.74,29.92 89.74,28.2 U41.38
21.3: length 66.8
  Bottom Layer w0.254: R160.2 98.13,75.76 99.4,74.49 99.4,25.73 98.1,24.44 U41.39
21.4: length 61.8
  Bottom Layer w0.254: R159.1 91.41,74.75 97.87,74.75 98.89,73.73 98.89,29.66 97.49,28.27 92.35,28.27 U41.40
21.5: length 55.3
  Bottom Layer w0.254: U41.41 95.69,29.52 98.25,32.08 98.25,66.75 97.62,67.38 92.16,67.38 91.78,67.76 91.78,72.08 91.39,72.46 R161.2
21.6: length 9.3
  Top Layer w0.254: 93.44,30.68 89.68,30.68 U41.42 ; MODE1.1 96.6,30.81 96.46,30.66 R68.2
21.7: length 19.5
  Top Layer w0.254: 93.97,44.66 93.85,44.79 ; 93.97,44.66 90.65,44.66 89.97,43.99 89.97,33.14 U41.43 ; 93.97,44.66 DOWN2.1
22.0: length 29
  Top Layer w0.305: U41.34 83.54,26.98 84.66,25.85 84.66,21.66 87.4,18.93 87.4,7.75 88.09,7.06 92.79,7.06 93.68,7.95 93.68,9.09
22.1: length 17.5
  Top Layer w0.305: U41.35 85.98,21.11 89.87,17.22 89.87,10.36 88.6,9.09
22.2: length 17.5
  Top Layer w0.305: U41.36 87.08,25.88 87.08,21.28 91.14,17.22 U40.4
22.3: length 17.5
  Top Layer w0.305: U41.37 88.52,20.98 92.41,17.09 92.41,10.49 91.14,9.22 91.14,9.09
23.1: length 34.6
  Top Layer w0.305: U41.33 83.44,21.36 86.7,18.11 86.7,7.06 87.58,6.17 94.19,6.17 94.95,6.93 94.95,9.81 95.5,10.36 96.98,10.36 98.25,11.63
33.4: length 30.2
  Bottom Layer w0.203: R183.1 67.03,12.38 67.52,11.88 74,11.88 74.52,12.41 CN11.4
  Bottom Layer w0.254: CN11.4 74.52,18.34 74.12,18.74 70.78,18.74 69.3,20.23 69.3,25.88 U41.22
33.5: length 34.9
  Bottom Layer w0.203: CN11.3 77.02,11.61 76.79,11.38 66.88,11.38 66.38,11.88 66.38,16.44 R184.1
  Bottom Layer w0.254: CN11.3 77.04,15.02 77.04,18.74 76.54,19.25 71.33,19.25 70.74,19.84 U41.23
33.6: length 123.3
  Top Layer w0.254: U41.24 71.73,26.98 71.96,26.74 71.96,23.57 71.2,22.81 v1(68.03,22.81)
  Top Layer w0.305: v1(39.83,22.93) 37.55,20.65 37.55,8.45 38.18,7.82 40.71,7.82 40.83,7.95
  Bottom Layer w0.254: v1(68.03,22.81) 67.9,22.93 v1(39.83,22.93) 39.45,23.31 39.45,52.52 33.61,58.37 20.27,58.37 18.62,60.02 18.62,71.84 U58.4
33.7: length 117
  Top Layer w0.254: v1(68.28,22.04) 72.6,22.04 73.28,22.72 U41.25
  Top Layer w0.305: v1(39.83,22.04) 38.18,20.39 38.18,9.98 38.69,9.47 40.83,9.47
  Bottom Layer w0.254: U58.3 17.37,59.75 19.64,57.48 32.85,57.48 38.44,51.89 38.44,22.81 39.2,22.04 v1(39.83,22.04) v1(68.28,22.04)
33.8: length 21.9
  Bottom Layer w0.254: CN11.1 82.02,19.36 81.52,19.87 72.62,19.87 71.96,20.52 71.96,25.66 U41.26
A45: length 49.2
  Top Layer w0.254: U41.114 41.38,39.67 39.71,41.35 14.43,41.35 13.92,40.84 13.92,33.22 12.54,31.84 R115.2 4.26,31.84 4.15,31.95 SW8.1
A46: length 57.4
  Top Layer w0.254: 10.86,18.36 10.86,29.14 11.26,29.54 13.8,29.54 14.69,30.43 14.69,40.33 15.19,40.84 38.31,40.84 40.7,38.45 44.12,38.45 U41.113
A47: length 39
  Top Layer w0.254: U41.112 42.14,42.87 13.29,42.87 12.78,42.36 12.78,37.92 12.13,37.27 R187.2 ; MODE4.1 11.23,37.24
A48: length 47.9
  Top Layer w0.254: U41.111 44.09,40.97 41.23,40.97 40.09,42.11 13.67,42.11 13.29,41.73 13.29,34.11 12.53,33.35 10.64,33.35 ; R114.2 10.64,33.35 ; 10.64,33.35 SW8.2
A49: length 34.7
  Top Layer w0.254: U41.110 11.79,44.76 11.26,45.28 R185.2 9.02,45.9 MODE2.1
BATT: length 1.8
  Top Layer w0.254: R123.1 13.92,18.36
$1N1871: length 2.8
  Top Layer w0.254: U2.1 31.12,17.22 C18.2
$1N1875: length 3.8
  Top Layer w0.254: U2.4 27.1,17.11 R110.2 24.44,15.81 R111.1
$1N3893: length 3.7
  Top Layer w0.254: R15.2 71.44,39.21 BUZZER2.1
$1N3894: length 3.7
  Top Layer w0.254: Q1.3 71.46,47.05 BUZZER2.2
$1N3895: length 1.7
  Top Layer w0.254: 72.44,54.7 72.44,53.03 72.41,53
$1N44233: length 13.5
  Top Layer w0.254: CN12.3 49.14,8.74 48.98,8.58 44.91,8.58 44.4,9.09 44.4,13.66 44.02,14.04 R144.2
$1N44311: length 14.4
  Top Layer w0.254: CN12.4 50.64,8.34 50.25,7.95 44.4,7.95 43.9,8.45 43.9,12.26 43.64,12.52 42.39,12.52
$1N44361: length 15.4
  Top Layer w0.254: 42.39,10.99 43.13,10.99 43.39,10.74 43.39,7.69 43.64,7.44 51.52,7.44 52.14,8.06 CN12.5
$1N44387: length 18.4
  Top Layer w0.254: R147.2 42.75,9.47 42.88,9.34 42.88,7.18 43.13,6.93 54.69,6.93 55.14,7.38 CN12.7
$1N44413: length 19.4
  Top Layer w0.254: CN12.8 56.64,7.1 55.84,6.3 42.5,6.3 42.13,6.66 R148.2
$1N44692: length 17.7
  Top Layer w0.254: R149.2 58.63,7.82 58.25,8.2 58.25,10.87 57.7,11.42 49.44,11.42 49.14,11.71 CN13.3
$1N44694: length 14.8
  Top Layer w0.254: 60.49,9.34 60.36,9.47 59.34,9.47 59.01,9.8 59.01,11.63 58.63,12.01 50.88,12.01 50.64,12.25 CN13.4
$1N44696: length 11.9
  Top Layer w0.254: 57.49,12.52 57.61,12.39 ; 57.49,12.52 58.96,12.52 59.52,11.97 59.52,11.32 59.85,10.99 R151.2 ; 57.49,12.52 52.28,12.52 52.14,12.66 CN13.5
$1N44698: length 7.3
  Top Layer w0.254: CN13.7 55.14,13.28 55.52,12.9 60.11,12.9 R152.2
$1N44700: length 5.3
  Top Layer w0.254: R153.2 60.01,13.57 56.82,13.57 56.64,13.75 CN13.8
$1N45394: length 4.5
  Bottom Layer w0.254: R160.1 87.71,75.76 86.95,75 U57.6
$1N45395: length 3.5
  Bottom Layer w0.254: R161.1 88.6,72.46 88.22,72.08 88.22,71.57 87.46,70.81 U57.5
$1N45396: length 15.4
  Bottom Layer w0.254: U57.2 81.23,73.35 80.35,72.46 80.35,69.67 80.85,69.16 88.71,69.16 89.47,69.92 R158.2
$1N45397: length 9.4
  Bottom Layer w0.254: U57.1 83.14,72.08 87.44,72.08 88.47,73.11 88.47,73.86 88.73,74.11 R159.2
$1N50660: length 1.6
  Top Layer w0.254: R162.1 13.12,66.24
$1N53160: length 2.3
  Top Layer w0.305: R163.1 54.7,18.71 LED5.1

## Copper pours and planes (outline as drawn; the poured copper is in the pictures)
GND on Top Layer: 0.13,24.04 21.78,24.04 21.78,13.79 44.4,13.79 44.4,16.2 59.77,16.2 59.77,4.14 -1.82,4.14 -1.82,23.95 0.04,23.95
GND on GND: 0.25,24.04 21.91,24.04 21.91,13.79 44.53,13.79 44.53,16.07 59.9,16.07 59.9,4.14 -1.7,4.14 -1.7,23.95 0.17,23.95
GND_MCU on Top Layer: -2.97,79.45 108.92,79.45 108.92,-1.83 -2.97,-1.83
GND_MCU on Bottom Layer: 70.78,18.74 73.49,18.74 73.49,12.65 70.78,12.65
GND_MCU on GND: -11.73,81.86 118.45,81.86 118.45,-6.28 -11.73,-6.28
VCC on Top Layer: 5.72,61.44 9.47,61.44 9.47,59.41 5.72,59.41
VCC on Top Layer: 17.1,24.08 29.33,24.08 29.33,20.01 17.1,20.01
VCC on Top Layer: 5.8,66.24 9.56,66.24 9.56,63.83 5.8,63.83
VCC on Top Layer: 66.82,19.25 68.79,19.25 68.79,17.85 66.82,17.85
VCC on Top Layer: 43.9,20.77 48.34,20.77 48.34,19.63 43.9,19.63
VCC on Top Layer: 26.62,28.14 46.31,28.14 46.31,22.55 26.62,22.55
VCC on VCC: 0,77.75 101.17,77.75 101.17,3.12 0,3.12
BAT on Top Layer: 13.31,12.47 30.31,12.47 30.31,5.53 13.31,5.53
BAT on VCC: 13.92,10.05 42.73,10.05 43.74,11.06 43.74,16.26 46.94,16.26 46.94,7.18 45.42,5.66 13.92,5.66
BATT on Top Layer: 1.48,19 19.51,19 19.51,11.33 1.48,11.33
$1N1872 on Top Layer: 30.68,24.2 37.04,24.2 37.04,8.96 30.68,8.96

Small or netless copper shapes (teardrops, artwork), in the pictures only: 238 on Top Layer, 98 on Bottom Layer

## Text on the board
Top Layer: 海南师范大学  独轮总能队  5-23
Top Silkscreen Layer: 屏幕 | 编码器1 | 摄像头   插口方向 | 无刷1 | 编码器2 | 无刷2 | 无线串口 | 陀螺仪接口 | 无线SPI | 电机接口 | 定位模块
